# Altium schematic sheet SDC_Latch_HS.SchDoc
size A; SheetNumber: 4; SheetTotal: 6
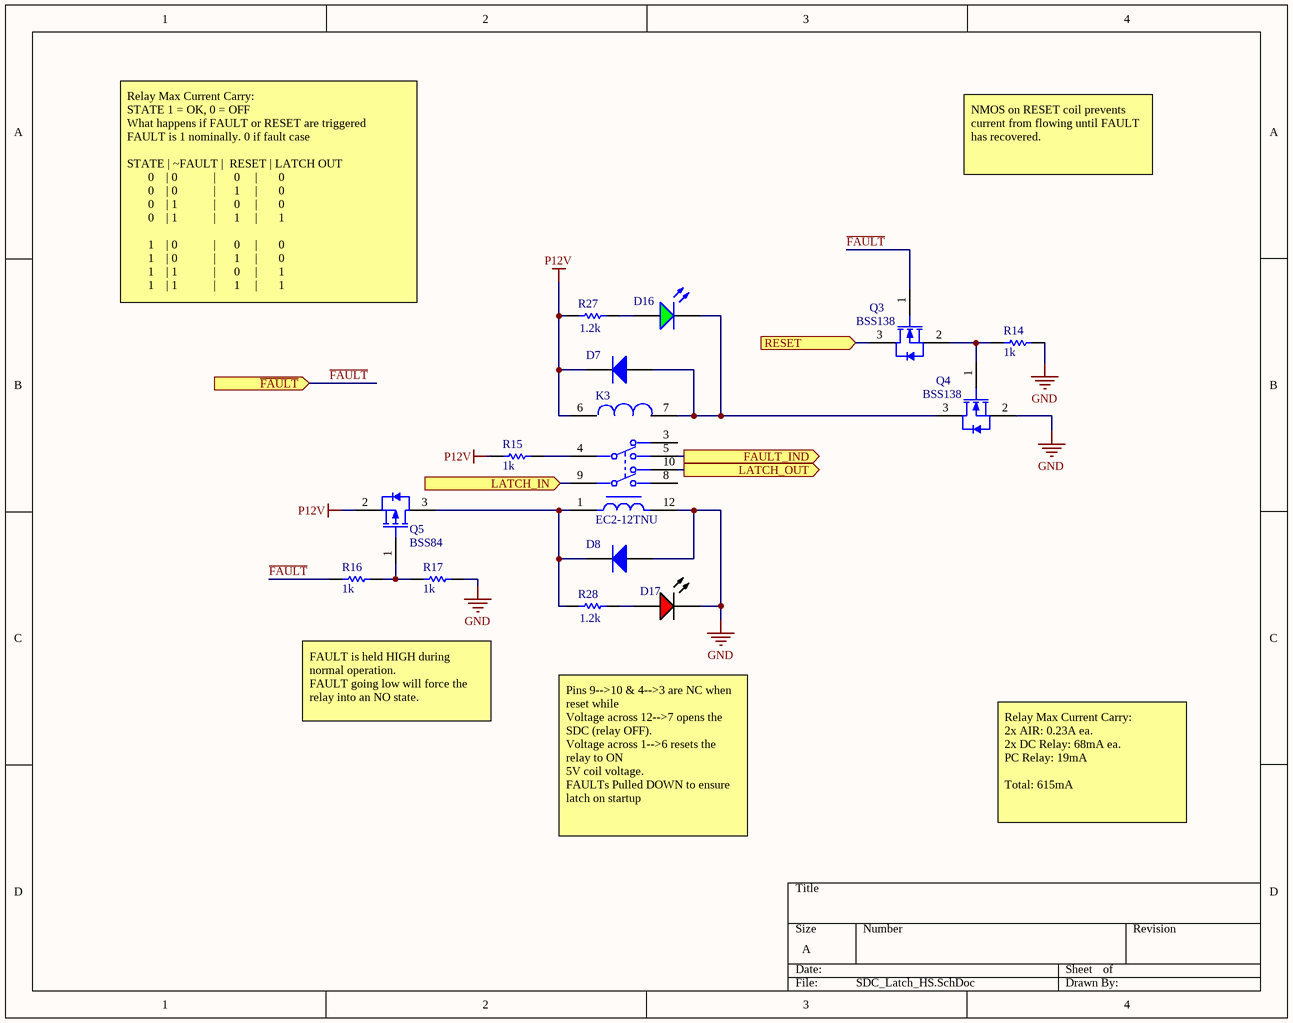
[diagram p0: SDC_Latch_HS.SchDoc]

## Parts
D7  Diode 1N4148  [DO-35]  (value not drawn)
D8  Diode 1N4148  [DO-35]  (value not drawn)
D16  597-3311-407F  [DIAL-597-3311-407F_V]  (value not drawn)
D17  SML-LX1206IC-TR  [LUMX-SML-LX1206IC_V]  (value not drawn)
K3  EC2-12TNU  [FP-EC2-12TNU-MFG]
Q3  BSS138  [FAIR-SOT23-3_V]
Q4  BSS138  [FAIR-SOT23-3_V]
Q5  BSS84  [FAIR-SOT23-3_V]
R14  value 1k  [RESC3116X70X50ML13T20]  (hidden comment: Resistor 1k +/-1% 1206 250 mW)
R15  value 1k  [RESC3116X70X50ML13T20]  (hidden comment: Resistor 1k +/-1% 1206 250 mW)
R16  value 1k  [RESC3116X70X50ML13T20]  (hidden comment: Resistor 1k +/-1% 1206 250 mW)
R17  value 1k  [RESC3116X70X50ML13T20]  (hidden comment: Resistor 1k +/-1% 1206 250 mW)
R27  1.2k  [RESC3216X70X50LL05T20]
R28  1.2k  [RESC3216X70X50LL05T20]

## Ports
FAULT_IND (out), LATCH_IN (in), LATCH_OUT (out), RESET (in), ~{FAULT} (in)

## Nets
GND: D8.1(A) D17.2(K) K3.12(SET-) Q4.2(S) R14.1 R17.1
P12V: D7.2(K) K3.6(RESET+) Q5.2(SOURCE) R15.2 R27.1
~{FAULT}: Q3.1(G) R16.2 ; port ~{FAULT}
FAULT_IND: K3.5 ; port FAULT_IND
LATCH_IN: K3.9 ; port LATCH_IN
LATCH_OUT: K3.10 ; port LATCH_OUT
RESET: Q3.3(D) ; port RESET
NetD7_1: D7.1(A) D16.2(K) K3.7(RESET-) Q4.3(D)
NetD8_2: D8.2(K) K3.1(SET+) Q5.3(DRAIN) R28.1
NetD16_1: D16.1(A) R27.2
NetD17_1: D17.1(A) R28.2
NetK3_4: K3.4 R15.1
NetQ3_2: Q3.2(S) Q4.1(G) R14.2
NetQ5_1: Q5.1(GATE) R16.1 R17.2

Not connected (* = marked no-connect by the designer): K3 3 8

## Notes on the sheet
- NMOS on RESET coil prevents current from flowing until FAULT has recovered.
- Relay Max Current Carry:
  STATE 1 = OK, 0 = OFF
  What happens if FAULT or RESET are triggered
  FAULT is 1 nominally. 0 if fault case
  STATE | ~FAULT |  RESET | LATCH OUT
  0    | 0            |      0     |       0
  0    | 0            |      1     |       0
  0    | 1            |      0     |       0
  0    | 1            |      1     |       1
  1    | 0            |      0     |       0
  1    | 0            |      1     |       0
  1    | 1            |      0     |       1
  1    | 1            |      1     |       1
- FAULT is held HIGH during normal operation.
  FAULT going low will force the relay into an NO state.
- Pins 9-->10 & 4-->3 are NC when reset while
  Voltage across 12-->7 opens the SDC (relay OFF).
  Voltage across 1-->6 resets the relay to ON
  5V coil voltage.
  FAULTs Pulled DOWN to ensure latch on startup
- Relay Max Current Carry:
  2x AIR: 0.23A ea.
  2x DC Relay: 68mA ea.
  PC Relay: 19mA
  Total: 615mA

## Library data of the parts
D7 D8 = Diode 1N4148: High Conductance Fast Diode; Published: 8-Jun-2000; LatestRevisionDate: 17-Jul-2002; LatestRevisionNote: Re-released for DXP Platform.; DatasheetVersion: 1997; PackageReference: DO-35; Publisher: Altium Limited; PackageDescription: Diode, Axial; Body 3.8 x 1.9 mm (LxDia. max), Lead Dia. 0.53 mm (max); Code_JEDEC: DO-204-AH; ComponentLink1Description: Manufacturer Link; ComponentLink1URL: http://www.fairchildsemi.com/; ComponentLink2Description: Datasheet; ComponentLink2URL: http://www.fairchildsemi.com/ds/1N%2F1N4148.pdf
D16 = CMP-2000-05651-1: LED Green, 75 mW, 30 mA, -30 to 85 degC, 2-Pin SMD, RoHS, Tape and Reel; Manufacturer: Dialight; Product Depth (mm): 1.5mm; Viewing Angle: 70deg; DELETED: Compliant; Number of  Elements: 1; Emitting Color: YellowGreen; Shape Type: Rectangular; Product Length (mm): 3mm; Forward Current: 30mA; Main Category: ChipLED; Luminous Intensity: 7.5mcd; Type: Uni-Color; High Brightness: No; Test Current (It): 20mA; Lens Type: NonDiffused; Reverse Voltage: 4V; Peak Wavelength: 560nm; Power Dissipation: 75W; Forward Voltage: 2.5V; Chip Material: GaP; Mounting: SurfaceMount; Product Height (mm): 1.5mm; Pin Count: 2; Datasheet URL: https://datasheet.ciiva.com/15117/getdatasheetpartid-142484-15117764.pdf; Mounting Technology: SurfaceMount; Rad Hardened: No; Operating Temperature Classification: Commercial; Lens Dimensions: 2x1.5x0.9mm; Operating Temp Range: -30Cto85C; Package Reference: 597-3311-407F; Package Type: SMD; Datasheet Version: 07/2002; Lum Intensity: 7.5mcd; Packaging: TapeandReel; Package Description: 2-Pin Surface Mount Device, Body 1.5 x 3 mm; Manufacturer URL: http://www.dialight.com/
D17 = CMP-2000-07123-1: LED Red, 65 mW, -40 to 85 degC, 2-Pin SMD, RoHS, Tape and Reel; Manufacturer: Lumex; LED Material: GaAsP; Peak Wavelength: 635nm; Number of LEDs: 1; Viewing Angle: 160; Reverse Voltage: 5(Min)V; Lens Appearance: ColorlessNonDiffused; Intensity: 6mcd; Type: Uni-Color; Pin_Count: 2; Lens Dimensions: 2x1.6x0.5mm; Mounting: SurfaceMount; ECCN: EAR99; RoHS: Unknown; Package Description: 2-Pin Surface Mount Device, Body 3.2 x 1.5 mm; Mounting Technology: SurfaceMount; Dominant Wavelength: N/A; Supplier_Package: SMD; Supplier Standard Pack: 3,000; Color: Red; Dimension: 3.2x1.6x1.1mm; HTS: 8541402000; Part No: SML-LX1206IC-TR; Family: SML-LX1206IC; Supplier: Lumex; Datasheet URL: http://www.lumex.com/content/files/ProductAttachment/SML-LX1206IC-TR.pdf; Package Reference: SML-LX1206IC; Manufacturer URL: http://www.lumexinstruments.com/; Operating Temperature: -25to85C; Packaging: TapeandReel; Datasheet Version: Rev. J, 08/2012
K3 = CMP-03195-000005-1: RELAY GEN PURPOSE DPDT 2A 12VDC; Manufacturer: KEMET; Switching Power: 60W; Coil Type: Latching and Dual Coil; Number Of Contacts: 2; Coil Resistance: 1028Ω; Coil Power: 140mW; Coil Voltage: 12V; Height: 9.4mm; Digikey Description: RELAY GEN PURPOSE DPDT 2A 12VDC; Device Class L2: Relays; Ambient Temperature Range High: +85°C; Current Rating: 2A; ComponentLink2Description: Datasheet; Device Class L1: Electromechanical; Switching Current: 2A; Ambient Temperature Range Low: -40°C; Device Class L3: Signal Relays; Package: 0; Octopart: https://octopart.com/ec2-12tnu-kemet-30529205; Throw Configuration: DPDT; Manufacturer Part Number: EC2-12TNU; Mouser Description: Relay; E-Mech; Latching; DPDT; Ctrl-V12DC; 2A; 250VAC; PCB Mnt; Thru Hole; EC2/EE2 Series; RoHS: TRUE; Automotive: No; Lead Free: Yes; Category: Relay; ComponentLink2URL: https://content.kemet.com/datasheets/KEM_R7002_EC2_EE2.pdf
Q3 Q4 = CMP-013-00021-2: N-Channel Logic Level Enhancement Mode Field Effect Transistor, 220 mA, 50 V, -55 to 150 degC, 3-Pin SOT-23, RoHS, Tape and Reel; Manufacturer: Fairchild; Nominal Vgs: 1.3V; Rds On Max: 3.5Ohm; Nominal Dual Supply Voltage: 50V; Package Version: Rev. 12, 03/2016; Typical Rise Time: 9ns; Elements: 1; Power: 360mW; Input Capacitance: 27pF; Resistance: 0.7Ohm; Package Reference: SOT23-3; Package Quantity: 1; Pins: 3; Mounting Technology: SM; Datasheet URL: https://www.fairchildsemi.com/datasheets/BS/BSS138.pdf; Max Operating Temperature: 150°C; Min Operating Temperature: -55°C; Datasheet Version: Rev. C, 10/2005; Package Description: 3-Pin Small Outline Transistor, Body 2.92 x 1.325 mm, Pitch 0.95 mm; Case/Package: TO-236-3; Packaging: TapeandReel; RoHS Compliant: True
Q5 = CMP-013-00022-2: P-Channel Enhancement Mode Field-Effect Transistor, 0.13 A, 50 V, -55 to 150 degC, 3-Pin SOT23, RoHS, Tape and Reel; Manufacturer: Fairchild; Nominal Dual Supply Voltage: -50V; Input Capacitance: 73pF; Typical Rise Time: 6.3ns; Nominal Vgs: -1.7V; Elements: 1; Rds On Max: 10Ohm; Power: 360mW; Package Version: Rev. 12, 03/2016; Package Quantity: 3000; Package Reference: SOT23-3; RoHS Compliant: True; Mounting Technology: SM; Max Operating Temperature: 150°C; Datasheet URL: https://www.fairchildsemi.com/datasheets/BS/BSS84.pdf; Package Description: 3-Pin Small Outline Transistor, Body 2.92 x 1.325 mm, Pitch 0.95 mm; Datasheet Version: Rev. 1.1.0, 02/2013; Packaging: TapeandReel; Pins: 3; Min Operating Temperature: -55°C; Case/Package: TO-236-3
R14-R17 = CMP-009-00011-4: Chip Resistor, 1 KOhm, +/- 1%, 0.25 W, -55 to 155 degC, 1206 (3216 Metric); Voltage Rating: 200V; Power: 250mW; Max Operating Temperature: 155°C; Case/Package: 1206; Pins: 2; RoHS Compliant: True; Min Operating Temperature: -55°C; Tolerance: 1%; Mounting Technology: SM
R27 R28 = CMP-2003-00061-1: ERJ8ENF1201V; Manufacturer: Panasonic; Part Number: ERJ8ENF1201V